# Altium schematic sheet nfc-epd-power.SchDoc
size A
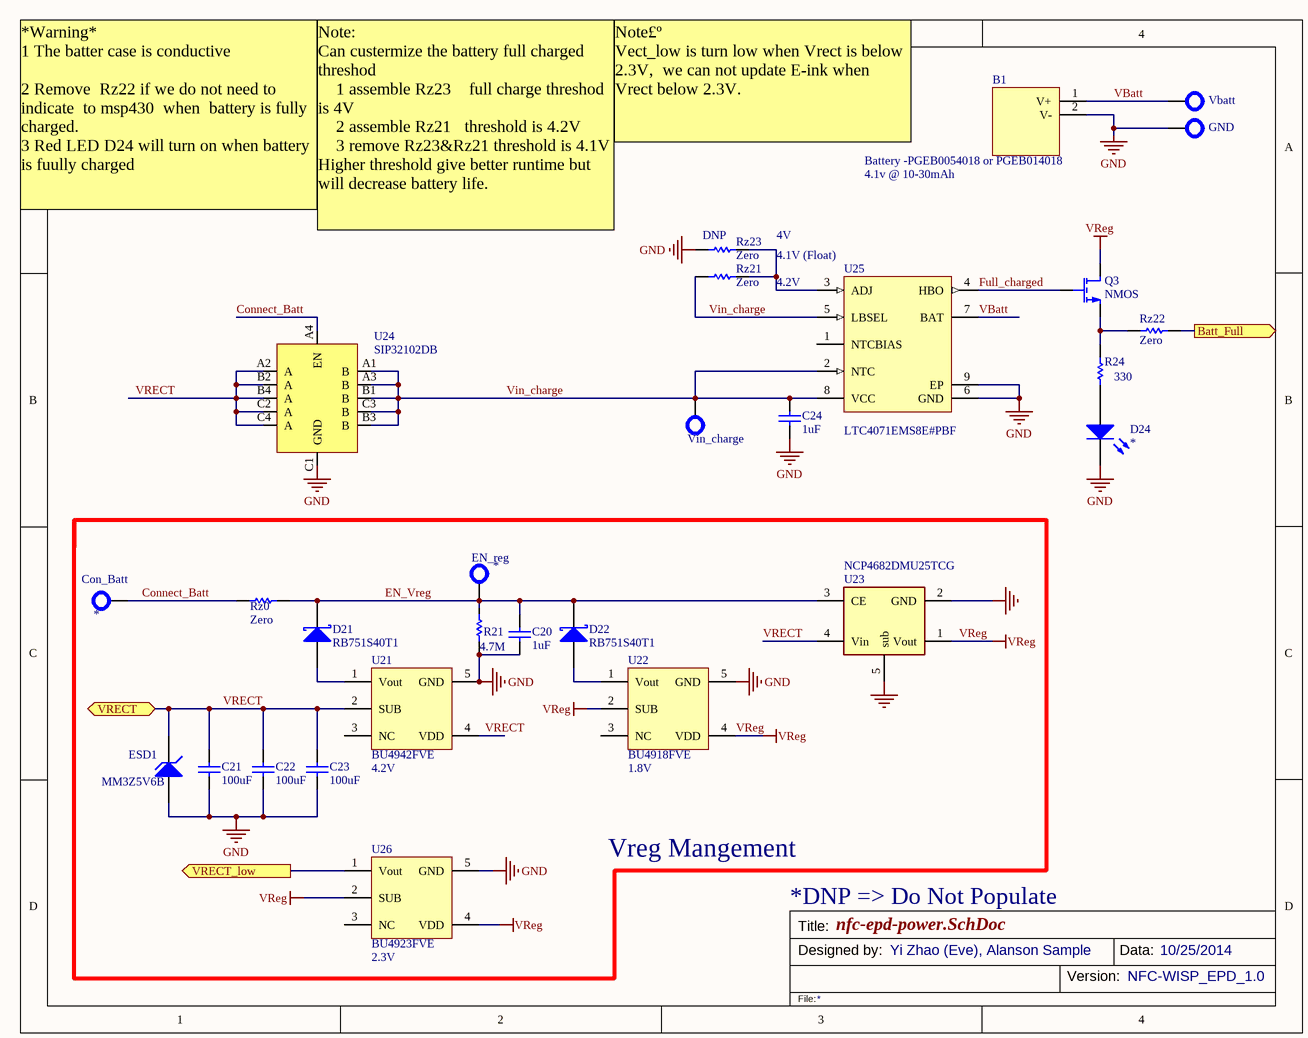
[diagram p0: nfc-epd-power.SchDoc]

## Parts
B1  Battery -PGEB0054018 or PGEB014018  value 4.1v @ 10-30mAh  [Battery -PGEB0054018-Pad_only]
C20  value 1uF  [0603]  (hidden comment: Cap)
C21  value 100uF  [1206]  (hidden comment: Cap)
C22  value 100uF  [1206]  (hidden comment: Cap)
C23  value 100uF  [1206]  (hidden comment: Cap)
C24  value 1uF  [0603]  (hidden comment: Cap)
Con_Batt  Test Point  [Test Point - Super Small]  (value not drawn)
D21  RB751S40T1  [SOD-523]
D22  RB751S40T1  [SOD-523]
D24  LED  [Diode - 0603]  (value not drawn)
EN_reg  Test Point  [Test Point - Small]  (value not drawn)
ESD1  MM3Z5V6B  [SOD-323]
GND1  GND  [Test Point - Super Small]
Q3  NMOS  [SOT-323 / SC-70]
R21  value 4.7M  [0603]  (hidden comment: Res)
R24  value 330  [0603]  (hidden comment: Res)
Rz0  value Zero  [0603]  (hidden comment: Res)
Rz21  value Zero  [0603]  (hidden comment: Res)
Rz22  value Zero  [0603]  (hidden comment: Res)
Rz23  value Zero  Note: DNP  [0603]  (hidden comment: Res)
U21  BU4942FVE  value 4.2V  [VSOF5/SOT665]
U22  BU4918FVE  value 1.8V  [VSOF5/SOT665]
U23  NCP4682DMU25TCG  [4-UDFN]
U24  SIP32102DB  [WCSP-12]
U25  LTC4071EMS8E#PBF  [LT-MS8E-8-1880X1680TP_N]
U26  BU4923FVE  Vaule: 2.3V  [VSOF5/SOT665]
Vbatt  Vbatt  [Test Point - Super Small]  (value not drawn)
Vin_charge  Test Point  [Test Point - Super Small]  (value not drawn)

## Blocks framed on the sheet
Vreg Mangement: C20-C23 Con_Batt D21 D22 EN_reg ESD1 R21 Rz0 U21-U23 U26

## Ports
Batt_Full (out), VRECT, VRECT_low (out)

## Nets
GND: B1.2(V-) C20.1 C21.1 C22.1 C23.1 C24.1 D24.2(K) ESD1.1(A) GND1.0 R21.1 Rz23.2 U21.5(GND) U22.5(GND) U23.2(GND) U23.5(sub) U24.C1(GND) U25.6(GND) U25.9(EP) U26.5(GND)
VReg: Q3.3(D) U22.2(SUB) U22.4(VDD) U23.1(Vout) U26.2(SUB) U26.4(VDD)
Batt_Full: Rz22.1 ; port Batt_Full
Connect_Batt: Con_Batt.0 Rz0.2 U24.A4(EN)
EN_Vreg: C20.2 D21.2(C) D22.2(C) EN_reg.0 R21.2 Rz0.1 U23.3(CE)
Full_charged: Q3.1(G) U25.4(HBO)
VBatt: B1.1(V+) U25.7(BAT) Vbatt.0
Vin_charge: C24.2 Rz21.2 U24.A1(B) U24.A3(B) U24.B1(B) U24.B3(B) U24.C3(B) U25.2(NTC) U25.5(LBSEL) U25.8(VCC) Vin_charge.0
VRECT: C21.2 C22.2 C23.2 ESD1.2(C) U21.2(SUB) U21.4(VDD) U23.4(Vin) U24.A2(A) U24.B2(A) U24.B4(A) U24.C2(A) U24.C4(A) ; port VRECT
VRECT_low: U26.1(Vout) ; port VRECT_low
NetD21_1: D21.1(A) U21.1(Vout)
NetD22_1: D22.1(A) U22.1(Vout)
NetD24_1: D24.1(A) R24.2
NetQ3_2: Q3.2(S) R24.1 Rz22.2
NetRz21_1: Rz21.1 Rz23.1 U25.3(ADJ)

Not connected (* = marked no-connect by the designer): U21 3(NC); U22 3(NC); U25 1(NTCBIAS); U26 3(NC)

## Notes on the sheet
- Note£º
  Vect_low is turn low when Vrect is below 2.3V,  we can not update E-ink when Vrect below 2.3V.
- *Warning*
  1 The batter case is conductive
  2 Remove  Rz22 if we do not need to indicate  to msp430  when  battery is fully charged.
  3 Red LED D24 will turn on when battery is fuully charged
- Note:
  Can custermize the battery full charged threshod
  1 assemble Rz23    full charge threshod is 4V
  2 assemble Rz21   threshold is 4.2V
  3 remove Rz23&Rz21 threshold is 4.1V
  Higher threshold give better runtime but will decrease battery life.
- 4V
- 4.2V
- 4.1V (Float)
- *DNP => Do Not Populate
- Title:
- Designed by:
- Yi Zhao (Eve), Alanson Sample
- Version:
- Data:
- NFC-WISP_EPD_1.0
- 10/25/2014
- File:

## Library data of the parts
B1 = Battery - MEC201: ThinFilm solid state battery  - 4.1V 1.0MAH; Manufacturer Part Number: MEC201-10S (several in same formfactor); Manufacturer: Infinite Power Solutions; Rating: *R; Note: DNP; Digi-Key Part Number: MEC201-10SCT-ND (several in same formfactor)
C20 C24 = Cap: Ceramic Capacitor (Surface Mount); Manufacturer: Generic Ceramic Chip Cap (TBD); Manufacturer Part Number 1: 0603ZD105KAT2A; Supplier Part Number 1: 478-1251-1-1ND; Note: *; Rating: *; Supplier 1: Digi-Key
C21-C23 = Cap: Ceramic Capacitor (Surface Mount); Manufacturer: Generic Ceramic Chip Cap (TBD); Digi-Key Part Number: *; Manufacturer Part Number: *; Note: *; Rating: *
Con_Batt EN_reg GND1 Vbatt Vin_charge = Test Point: Test Point, large or small foot prints; Manufacturer Part Number: Example: 5000, 5013; Manufacturer: Keystone Electronics; Digi-Key Part Number: Example: 5000K-ND, 5012K-ND, Surface mount 5015KCT-ND; Note: *; Rating: *; Value: *
D21 D22 = RB751S40T1: Schottky Diode; Published: 8-Jun-2000; LatestRevisionDate: 17-Jul-2002; LatestRevisionNote: Re-released for DXP Platform.; PackageReference: SMB; Publisher: Altium Limited; Code_JEDEC: DO-214-AA
D24 = Diode - LED: Typical RED, GREEN, YELLOW, AMBER GaAs LED; Digi-Key Part Number: *; Manufacturer: *; Manufacturer Part Number: *; Note: *; Value: *; Rating: *
ESD1 = MM3Z4V3B: Vz=5.6V, Overvoltage Protection Zener; Manufacturer: Fairchild; Manufacturer Part Number: MM3Z5V6B; Digi-Key Part Number: MM3Z5V6BCT-ND; Value: *; Rating: *; Note: *; Supplier 1: Digi-Key; Supplier Part Number 1: MM3Z5V6BCT-ND
Q3 = MOSFET-N: N-Channel MOSFET; Digi-Key Part Number: *; Manufacturer Part Number: *; Manufacturer: *; Notes: *; Rating: *; Value: NMOS
R21 R24 = Res: Chip Resistor (Surface Mount); Manufacturer: Generic Chip Res (TBD); Manufacturer Part Number: *; Digi-Key Part Number: *; Rating: *; Note: *
Rz0 Rz21-Rz23 = Res: Chip Resistor (Surface Mount); Manufacturer: Generic Chip Res (TBD); Manufacturer Part Number: RC0603FR-070RL; Digi-Key Part Number: *; Rating: *; Supplier 1: Digi-Key; Supplier Part Number 1: 311-0.0HRCT-ND
U21 U22 U26 = BU49xxFVE: VSOF-5,Supervisor; Digi-Key Part Number: *; Distributor: *; Distributor Part Number: *; Manufacture: *; Manufacture Part Number: *; Note: *; Rating: *; Supplier 1: Digi-Key
  U21: Supplier Part Number 1: BU4942FVE-TR-ND
  U22: Supplier Part Number 1: BU4918FVE-TR-ND
  U26: Supplier Part Number 1: BU4923FVE-TR-ND
U23 = NCP4682DMU25TCG: Regulator: LDO  NCP4682 (with enable), 4-UDFN package; Manufacturer: ON Semiconductor; Digi-Key Part Number: NCP4682DMU25TCGOSCT-ND; Manufacturer Part Number: NCP4682DMU25TCG; Rating: *; Value: *; Note: *; Supplier 1: Digi-Key; Supplier Part Number 1: NCP4682DMU25TCGOSCT-ND
U24 = SIP32102DB: Bi-directional Load Switch; Supplier 1: Digi-Key; Supplier Part Number 1: SIP32102DB-T1-GE1CT-ND
U25 = LTC4071EMS8E#PBF: Li-Ion / Polymer Shunt Battery Charger System with Low Battery Disconnect, 8-pin SOP (MS8E-8), -40 to 125 degC, Pb-Free; Manufacturer: Linear Technology; Number of Outputs: 1; DatasheetVersion: Rev. C; PackageVersion: Rev. F; PackageReference: MS8E-8; PackageDescription: 8-Pin Plastic MSOP, Exposed Die Pad, Body 3 x 3 mm, Pitch 0.65 mm; Supplier 1: Digi-Key; Supplier Part Number 1: LTC4071EMS8E#PBF-ND; Supplier 2: Farnell; Supplier Part Number 2: 1947919; Supplier 3: Newark; Supplier Part Number 3: 13T8411; RoHS: TRUE; Topology: Shunt Battery Charger; Mounting Technology: Surface Mount; PartNumber: LTC4071EMS8E#PBF; ComponentLink1Description: Manufacturer URL; ComponentLink1URL: http://www.linear.com/; ComponentLink2Description: Datasheet; ComponentLink2URL: http://cds.linear.com/docs/en/datasheet/4071fc.pdf; ComponentLink3Description: Package Specification; ComponentLink3URL: http://cds.linear.com/docs/en/datasheet/3080fc.pdf